# EAGLE design Temp1 (EAGLE 7.5.0)
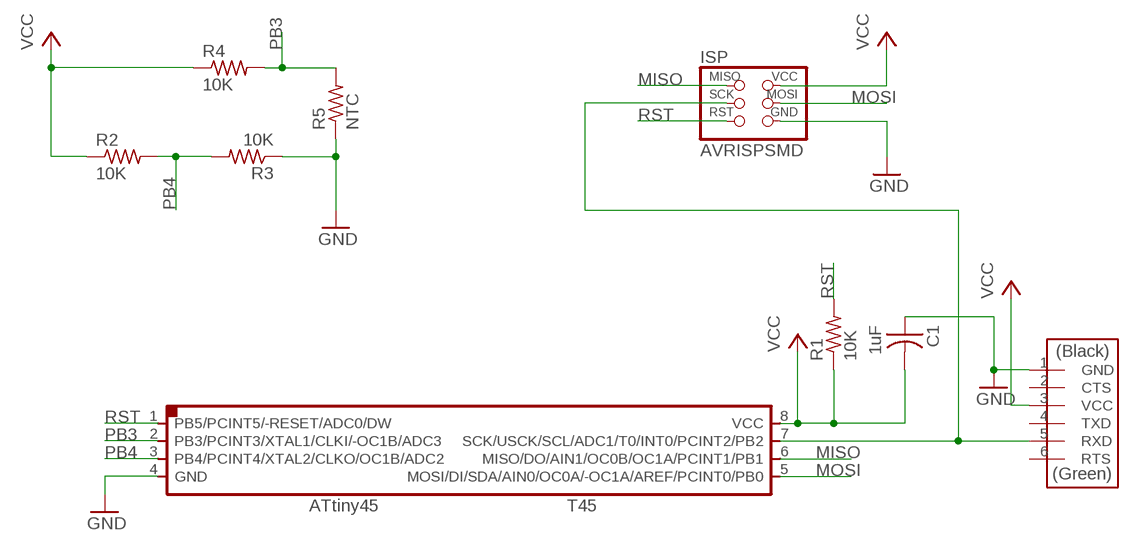
[diagram p0: schematic, sheet 1]

## Parts
C1  1uF  CAP-US1206FAB  [C1206FAB]
FDTI  FTDI-SMD-HEADER  [1X06SMD]
ISP  AVRISPSMD  [2X03SMD]
R1  10K  RES-US1206FAB  [R1206FAB]
R2  10K  RES-US1206FAB  [R1206FAB]
R3  10K  RES-US1206FAB  [R1206FAB]
R4  10K  RES-US1206FAB  [R1206FAB]
R5  NTC  RES-US1206FAB  [R1206FAB]
T45  ATTINY45SI  [SOIC8]

## Nets
GND: C1.1 FDTI.1(GND) ISP.6(GND) R3.1 R5.1 T45.4(GND)
MISO: ISP.1(MISO) T45.6(MISO/DO/AIN1/OC0B/OC1A/PCINT1/PB1)
MOSI: ISP.4(MOSI) T45.5(MOSI/DI/SDA/AIN0/OC0A/-OC1A/AREF/PCINT0/PB0)
N$1: FDTI.5(RXD) ISP.3(SCK) T45.7(SCK/USCK/SCL/ADC1/T0/INT0/PCINT2/PB2)
PB3: R4.2 R5.2 T45.2(PB3/PCINT3/XTAL1/CLKI/-OC1B/ADC3)
PB4: R2.2 R3.2 T45.3(PB4/PCINT4/XTAL2/CLKO/OC1B/ADC2)
RST: ISP.5(RST) R1.2 T45.1(PB5/PCINT5/-RESET/ADC0/DW)
VCC: C1.2 FDTI.3(VCC) ISP.2(VCC) R1.1 R2.1 R4.1 T45.8(VCC)
Unconnected: FDTI.2(CTS) FDTI.4(TXD) FDTI.6(RTS)

## Library data of the parts
C1 = fab:CAP-US
FDTI = fab:FTDI-SMD-HEADER
ISP = fab:AVRISP
R1-R5 = fab:RES-US: Resistor (US Symbol) Variants with postfix FAB are widened to allow the routing of internal traces
T45 = fab:ATTINY45

## Board
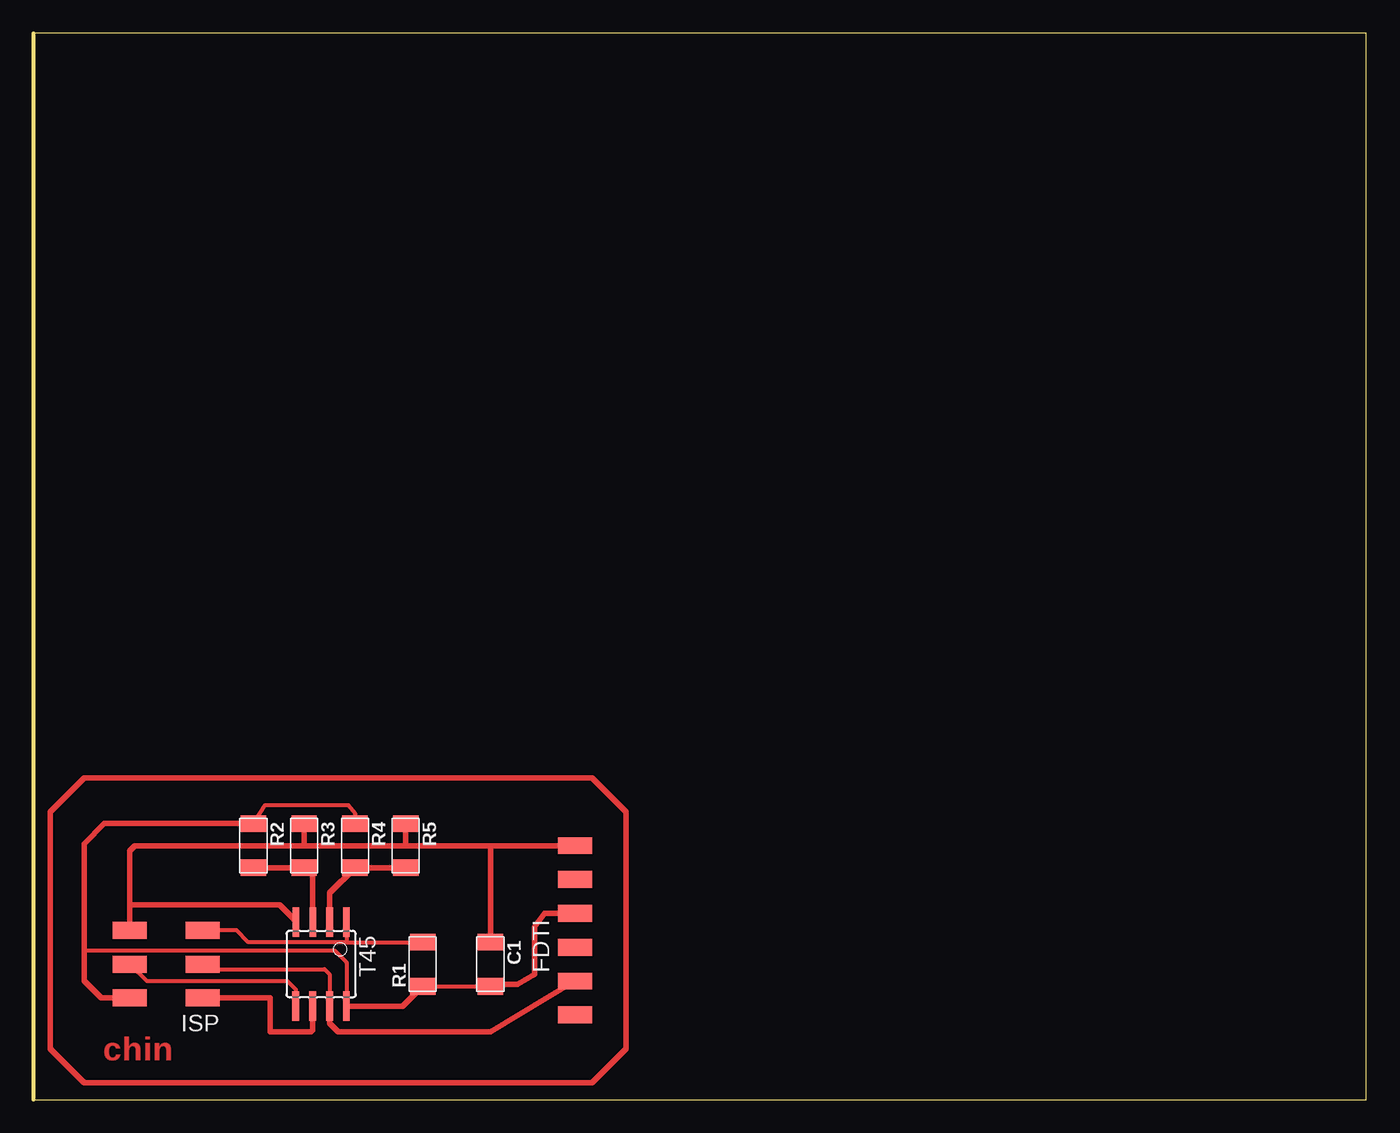
[diagram p1: board, top side]

Size 100 x 80 mm. Coordinates in mm from the lower left corner, seen from the top.
Outline: 0,0 100,0 100,80 0,80 0,0
Copper layers (1*16): Top 0.035mm / dielectric 1.5mm / Bottom 0.035mm
Design rules "default": minimum track width 10mil, minimum drill 24mil, track to track 8mil, track to pad 8mil, pad to pad 8mil, via to via 8mil, smd to smd 8mil, copper to edge 40mil, drill to drill 8mil, minimum pad ring 10mil, minimum via ring 8mil, stop-mask expansion 4mil, vias tented up to drill 0mil, thermal gap 10mil

### Footprints (pad centres in the part's own frame; a part is rotated, then mirrored left to right if it is on the bottom)
C1206FAB = smd 1.27 x 1.905: 1 -1.651,0; 2 1.651,0
1X06SMD = smd 2.54 x 1.27: 1 0,6.35; 2 0,3.81; 3 0,1.27; 4 0,-1.27; 5 0,-3.81; 6 0,-6.35
2X03SMD = smd 2.54 x 1.27: 1 -2.54,2.54; 2 2.92,2.54; 3 -2.54,0; 4 2.92,0; 5 -2.54,-2.54; 6 2.92,-2.54
R1206FAB = smd 1.27 x 1.905: 1 -1.651,0; 2 1.651,0
SOIC8 = smd 0.5 x 2.2: 1 -1.905,-3.154; 2 -0.645,-3.154; 3 0.625,-3.154; 4 1.895,-3.154; 5 1.905,3.154; 6 0.635,3.154; 7 -0.635,3.154; 8 -1.905,3.154

### Placement (x,y rotation side)
C1  34.29,10.16 270 top
FDTI  40.64,12.7 0 top
ISP  10.16,10.16 180 top
R1  29.21,10.16 90 top
R2  16.51,19.05 270 top
R3  20.32,19.05 270 top
R4  24.13,19.05 270 top
R5  27.94,19.05 270 top
T45  21.59,10.16 180 top

### Tracks (layer width: path | path; a pad name or v marks a point on that pad's centre or on a via)
GND
  Top 0.305: 19.58,13.51 T45.4
  Top 0.406: FDTI.1 34.29,19.05 | 34.29,19.05 27.94,19.05 | 27.94,19.05 20.32,19.05 | 20.32,19.05 7.62,19.05 7.24,18.67 7.24,14.61 | 7.24,14.61 ISP.6 | R5.1 27.94,19.05 | R3.1 20.32,19.05 | C1.1 34.29,19.05 | 19.58,13.51 18.49,14.61 7.24,14.61
MISO
  Top 0.305: 20.83,5.08 20.95,5.21
  Top 0.406: ISP.1 17.78,7.62 17.78,5.08 20.83,5.08 | 20.95,5.21 T45.6
MOSI
  Top 0.305: ISP.4 8.51,8.89 19.05,8.89 19.68,8.26 T45.5
N$1
  Top 0.305: ISP.3 13.08,9.78 21.84,9.78 22.23,9.4 T45.7
  Top 0.406: T45.7 22.23,5.71 22.86,5.08 34.29,5.08 FDTI.5
N$2
  Top 0.406: 1.27,21.59 3.81,24.13 41.91,24.13 44.45,21.59 44.45,3.81 41.91,1.27 3.81,1.27 1.27,3.81 1.27,21.59
PB3
  Top 0.406: R5.2 R4.2 22.23,15.5 T45.2
PB4
  Top 0.305: R3.2 20.96,16.75
  Top 0.406: R2.2 R3.2 | 20.96,16.75 T45.3
RST
  Top 0.305: 23.5,11.81 16.13,11.81 15.24,12.7 ISP.5 | T45.1 23.5,11.81 | 23.5,11.81 R1.2
VCC
  Top 0.305: R1.1 C1.2 34.16,8.64 | ISP.2 6.35,7.62 | 3.81,11.18 22.61,11.18 23.5,10.29 T45.8 | R2.1 16.64,20.95 17.4,22.1 23.62,22.1 24.13,21.46 R4.1
  Top 0.406: FDTI.3 38.35,13.97 37.59,12.95 37.59,9.4 36.32,8.64 34.16,8.64 | ISP.2 5.08,7.62 3.81,8.89 3.81,11.18 3.81,19.18 5.33,20.7 R2.1 | T45.8 27.71,7.01 R1.1

### Text on the board
Top: chin